# Altium project BatteryBoard.PrjPcb
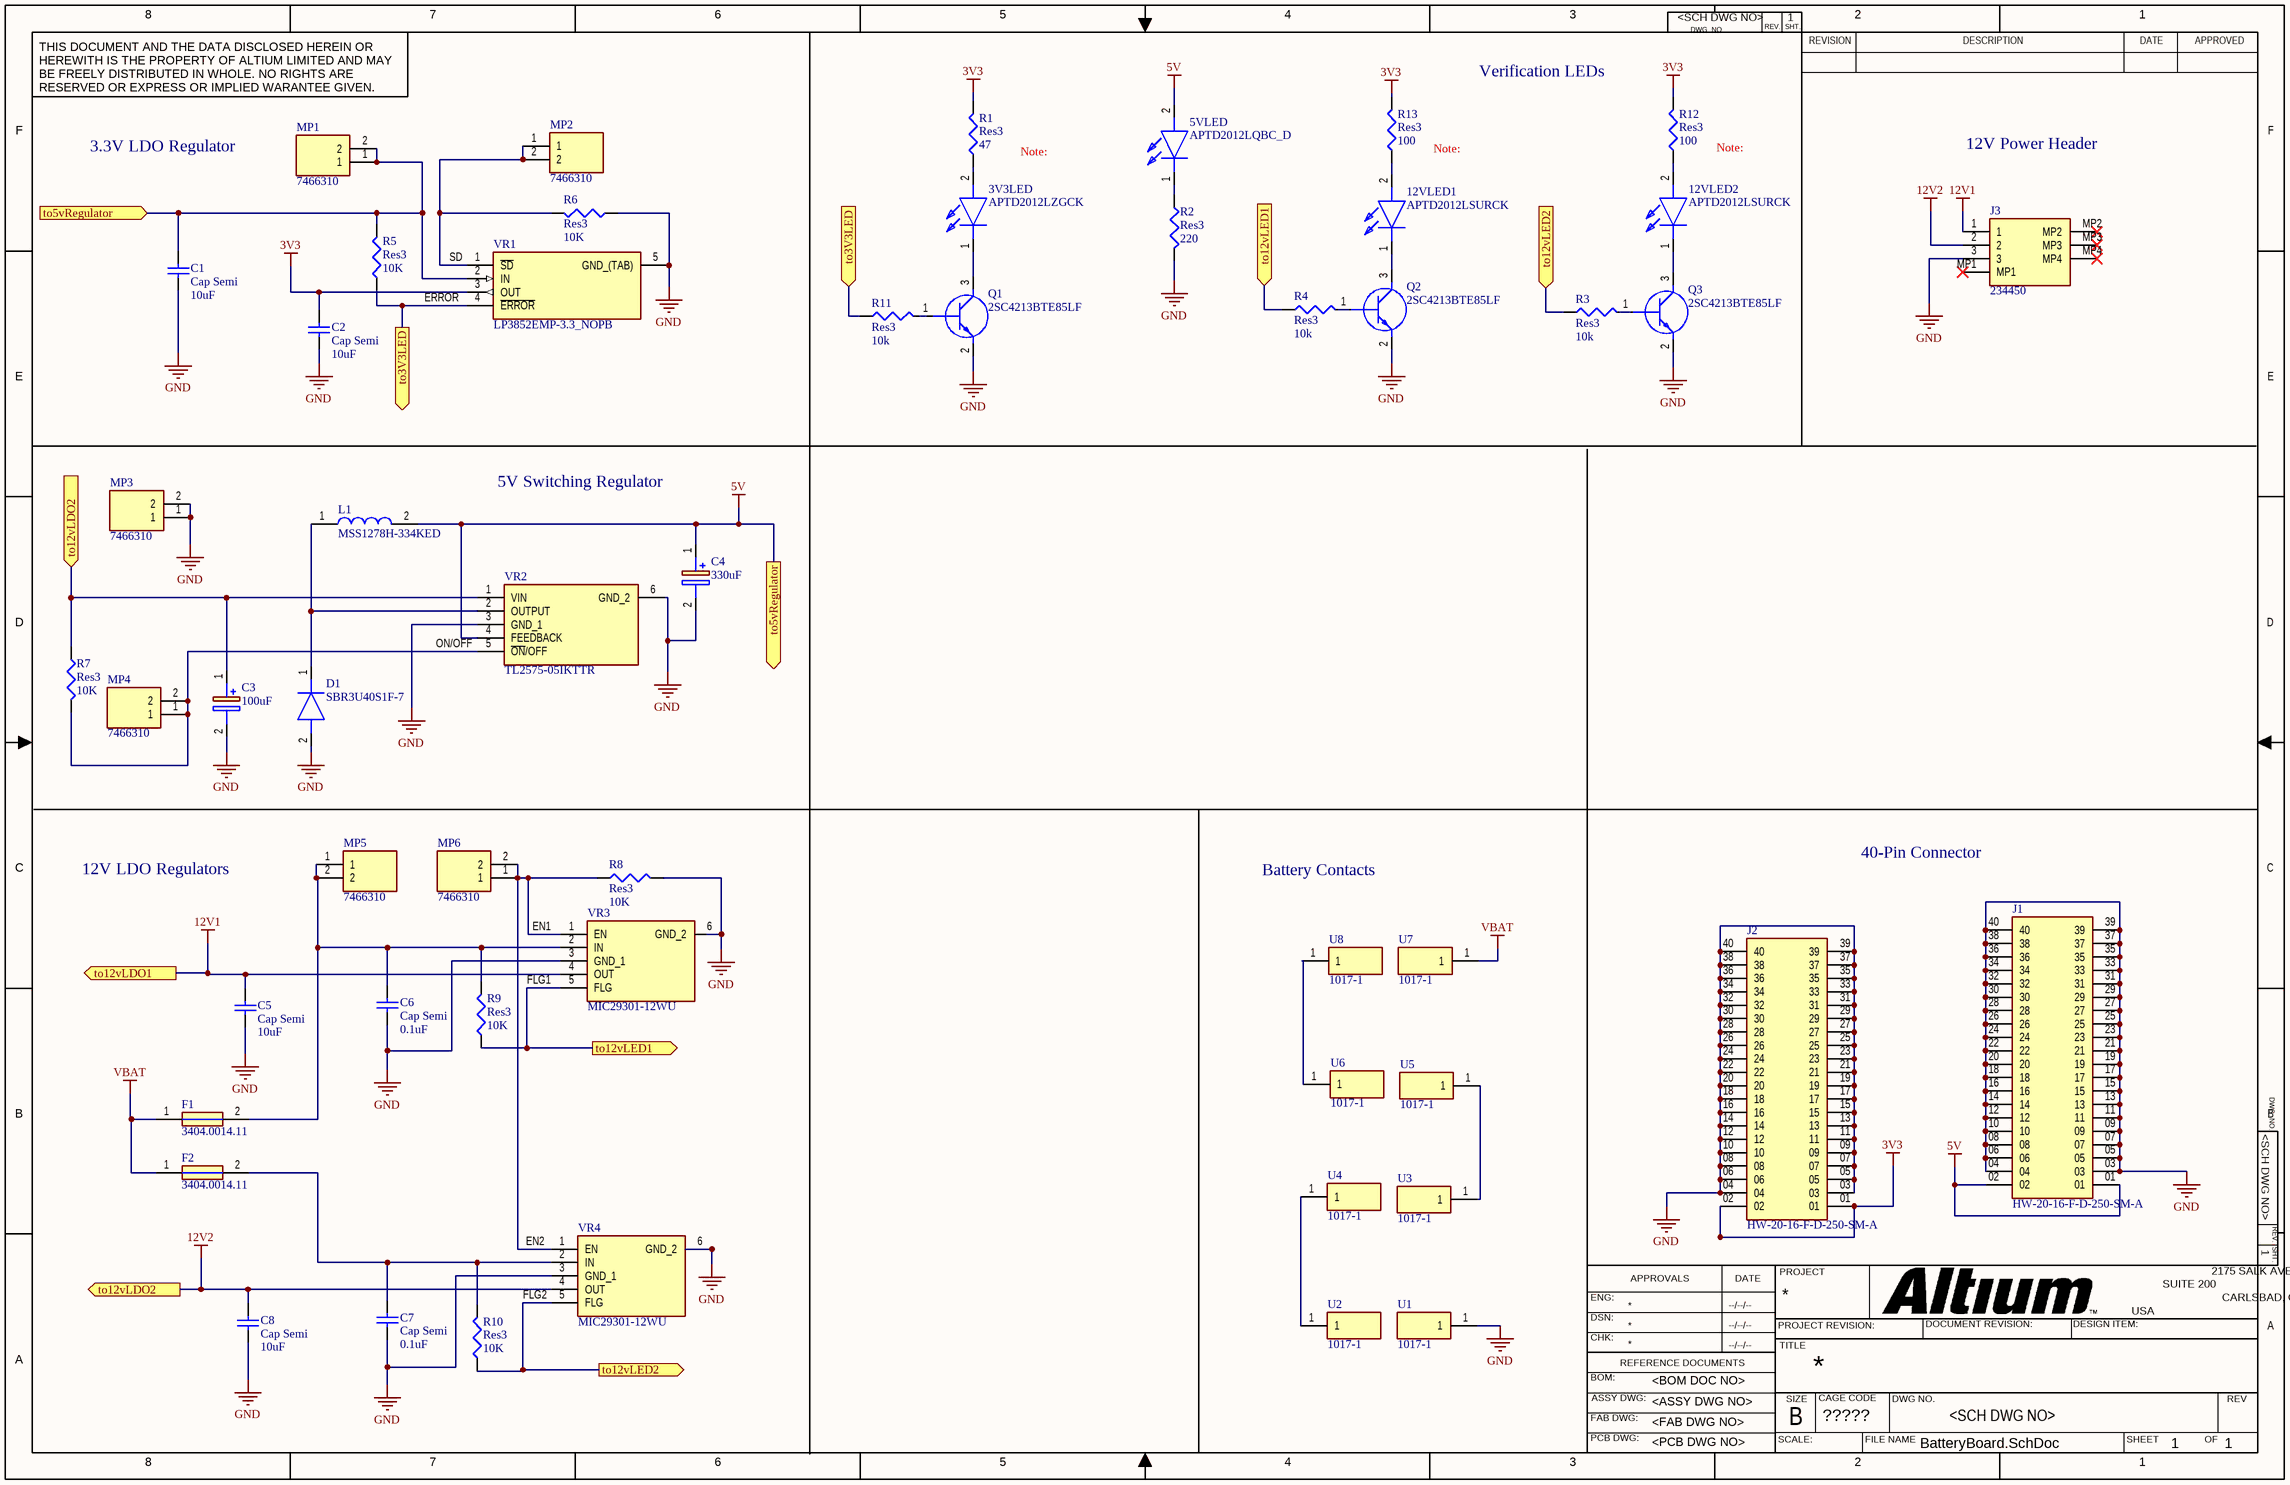
[diagram p0: BatteryBoard.SchDoc]
CAGE_CODE: ?????; CONTRACT_NUMBER: <CONTRACT NO>; DOC_NO_ASSY_DWG: <ASSY DWG NO>; DOC_NO_BOM: <BOM DOC NO>; DOC_NO_FAB_DWG: <FAB DWG NO>; DOC_NO_SCH_DWG: <SCH DWG NO>; PCB_2_DEC_TOL: +/-.01; PCB_3_DEC_TOL: +/-.010; PCB_ANG_TOL: +/-1/2; PCB_ASSEMBLY_NO: <PCB ASSY NO>; PCB_CHECKER: - -----; PCB_CHECKER_APP_DATE: --/--/----; PCB_DESIGNER: - -----; PCB_DESIGNER_APP_DATE: --/--/----; PCB_DWG_NO: <PCB DWG NO>; PCB_ENGINEER: - -----; PCB_ENGINEER_APP_DATE: --/--/----; PCB_PART_NUMBER: <PCB PN>; PCB_REV: A; SCH_REV: A
1 sheet, 53 parts. Net scope: flat (ports and power ports of the same name join across sheets).
Board file: BatteryBoard.PcbDoc

## Sheet BatteryBoard.SchDoc
size 431 x 279 mm; SheetNumber: 1; SheetTotal: 1; ENG_APP_DATE: --/--/--; DSN_APP_DATE: --/--/--; CHK_APP_DATE: --/--/--

### Parts
3V3LED  APTD2012LZGCK  [LEDC2012X105N]
5VLED  APTD2012LQBC_D  [LEDC2012X120N]
12VLED1  APTD2012LSURCK  [LEDM2012X120N]
12VLED2  APTD2012LSURCK  [LEDM2012X120N]
C1  Cap Semi  value 10uF  [C1206]
C2  Cap Semi  value 10uF  [C1206]
C3  100uF  [EEEHP1H4R7P]
C4  330uF  [CAPAE660X800N]
C5  Cap Semi  value 10uF  [C1206]
C6  Cap Semi  value 0.1uF  [C1206]
C7  Cap Semi  value 0.1uF  [C1206]
C8  Cap Semi  value 10uF  [C1206]
D1  SBR3U40S1F-7  [SODFL3518X115N]
F1  3404.0014.11  [FUSM7431X260N]
F2  3404.0014.11  [FUSM7431X260N]
J1  HW-20-16-F-D-250-SM-A  [SAMTEC_HW-20-16-F-D-250-SM-A]
J2  HW-20-16-F-D-250-SM-A  [SAMTEC_HW-20-16-F-D-250-SM-A]
J3  234450  [234450]
L1  MSS1278H-334KED  [MSS1278H334KED]
MP1  7466310  [7466310]
MP2  7466310  [7466310]
MP3  7466310  [7466310]
MP4  7466310  [7466310]
MP5  7466310  [7466310]
MP6  7466310  [7466310]
Q1  2SC4213BTE85LF  [SOT65P210X110-3N]
Q2  2SC4213BTE85LF  [SOT65P210X110-3N]
Q3  2SC4213BTE85LF  [SOT65P210X110-3N]
R1  Res3  value 47  [J1-0603]
R2  Res3  value 220  [J1-0603]
R3  Res3  value 10k  [J1-0603]
R4  Res3  value 10k  [J1-0603]
R5  Res3  value 10K  [J1-0603]
R6  Res3  value 10K  [J1-0603]
R7  Res3  value 10K  [J1-0603]
R8  Res3  value 10K  [J1-0603]
R9  Res3  value 10K  [J1-0603]
R10  Res3  value 10K  [J1-0603]
R11  Res3  value 10k  [J1-0603]
R12  Res3  value 100  [J1-0603]
R13  Res3  value 100  [J1-0603]
U1  1017-1  [10171]
U2  1017-1  [10171]
U3  1017-1  [10171]
U4  1017-1  [10171]
U5  1017-1  [10171]
U6  1017-1  [10171]
U7  1017-1  [10171]
U8  1017-1  [10171]
VR1  LP3852EMP-3.3_NOPB  [SOT150P700X180-5N]
VR2  TL2575-05IKTTR  [TL1963AQKTTRQ1]
VR3  MIC29301-12WU  [MIC2930133WUTR]
VR4  MIC29301-12WU  [MIC2930133WUTR]

### Ports
to3V3LED (in), to3V3LED (out), to5vRegulator (in), to5vRegulator (out), to12vLDO1 (out), to12vLDO2 (in), to12vLDO2 (out), to12vLED1 (in), to12vLED1 (out), to12vLED2 (in), to12vLED2 (out)

### Nets
3V3: C2.2 J2.01 J2.02 R1.2 R12.2 R13.2 VR1.3(OUT)
5V: 5VLED.2(A) C1.2 C4.1(+) J1.01 J1.02 L1.2 MP1.1 MP1.2 R5.2 VR1.2(IN) VR2.4(FEEDBACK) ; port to5vRegulator
12V1: C5.2 J3.1 VR3.4(OUT) ; port to12vLDO1
12V2: C3.1(+) C8.2 J3.2 R7.1 VR2.1(VIN) VR4.4(OUT) ; port to12vLDO2
GND: C1.1 C2.1 C3.2(-) C4.2(-) C5.1 C6.2 C7.2 C8.1 D1.2(A) J1.03 J1.04 J1.05 J1.06 J1.07 J1.08 J1.09 J1.10 J1.11 J1.12 J1.13 J1.14 J1.15 J1.16 J1.17 J1.18 J1.19 J1.20 J1.21 J1.22 J1.23 J1.24 J1.25 J1.26 J1.27 J1.28 J1.29 J1.30 J1.31 J1.32 J1.33 J1.34 J1.35 J1.36 J1.37 J1.38 J1.39 J1.40 J2.03 J2.04 J2.05 J2.06 J2.07 J2.08 J2.09 J2.10 J2.11 J2.12 J2.13 J2.14 J2.15 J2.16 J2.17 J2.18 J2.19 J2.20 J2.21 J2.22 J2.23 J2.24 J2.25 J2.26 J2.27 J2.28 J2.29 J2.30 J2.31 J2.32 J2.33 J2.34 J2.35 J2.36 J2.37 J2.38 J2.39 J2.40 J3.3 MP3.1 MP3.2 Q1.2(E) Q2.2(E) Q3.2(E) R2.2 R6.1 R8.2 U1.1 VR1.5(GND_(TAB)) VR2.3(GND_1) VR2.6(GND_2) VR3.3(GND_1) VR3.6(GND_2) VR4.3(GND_1) VR4.6(GND_2)
VBAT: F1.1 F2.1 U7.1
EN1: MP6.1 MP6.2 R8.1 VR3.1(EN) VR4.1(EN)  [also labelled EN2]
ERROR: R5.1 R11.1 VR1.4(~{ERROR}) ; port to3V3LED
FLG1: R4.1 R9.1 VR3.5(FLG) ; port to12vLED1
FLG2: R3.1 R10.1 VR4.5(FLG) ; port to12vLED2
ON/OFF: MP4.1 MP4.2 R7.2 VR2.5(~{ON}/OFF)
SD: MP2.1 MP2.2 R6.2 VR1.1(~{SD})
Net3V3LED_1: 3V3LED.1(K) Q1.3(C)
Net3V3LED_2: 3V3LED.2(A) R1.1
Net5VLED_1: 5VLED.1(K) R2.1
Net12VLED1_1: 12VLED1.1(K) Q2.3(C)
Net12VLED1_2: 12VLED1.2(A) R13.1
Net12VLED2_1: 12VLED2.1(K) Q3.3(C)
Net12VLED2_2: 12VLED2.2(A) R12.1
NetC6_1: C6.1 F1.2 MP5.1 MP5.2 R9.2 VR3.2(IN)
NetC7_1: C7.1 F2.2 R10.2 VR4.2(IN)
NetD1_1: D1.1(K) L1.1 VR2.2(OUTPUT)
NetQ1_1: Q1.1(B) R11.2
NetQ2_1: Q2.1(B) R4.2
NetQ3_1: Q3.1(B) R3.2
NetU2_1: U2.1 U4.1
NetU3_1: U3.1 U5.1
NetU6_1: U6.1 U8.1

Not connected (* = marked no-connect by the designer): J3 MP1* MP2* MP3* MP4*

### Notes on the sheet
- Verification LEDs
- 3.3V LDO Regulator
- Note:
- 12V Power Header
- 5V Switching Regulator
- 12V LDO Regulators
- Battery Contacts
- 40-Pin Connector
- 8
- 7
- 6
- 5
- 4
- 3
- DWG. NO.
- REV.
- SHT.
- 2
- 1
- THIS DOCUMENT AND THE DATA DISCLOSED HEREIN OR HEREWITH IS THE PROPERTY OF ALTIUM LIMITED AND MAY BE FREELY DISTRIBUTED IN WHOLE. NO RIGHTS ARE RESERVED OR EXPRESS OR IMPLIED WARANTEE GIVEN.
- REVISION
- DESCRIPTION
- DATE
- APPROVED
- F
- E
- D
- C
- B
- ENG:
- APPROVALS
- PROJECT
- SUITE 200
- 2175 SALK AVENUE
- CARLSBAD, CA 92008
- A
- DSN:
- CHK:
- REFERENCE DOCUMENTS
- PROJECT REVISION:
- TITLE
- DOCUMENT REVISION:
- DESIGN ITEM:
- USA
- BOM:
- FAB DWG:
- PCB DWG:
- ASSY DWG:
- SCALE:
- SIZE
- CAGE CODE
- FILE NAME
- DWG NO.
- SHEET
- OF
- REV

### Library data of the parts
3V3LED = APTD2012LZGCK: LED; Manufacturer_Name: Kingbright; Datasheet Link: http://www.kingbrightusa.com/images/catalog/SPEC/APTD2012LZGCK.pdf; Height: 1.05mm; Manufacturer_Part_Number: APTD2012LZGCK; Mouser Part Number: 604-APTD2012LZGCK; Mouser Price/Stock: https://www.mouser.co.uk/ProductDetail/Kingbright/APTD2012LZGCK?qs=AQlKX63v8RvUnlqpSGhMeA%3D%3D; Arrow Part Number: APTD2012LZGCK; Arrow Price/Stock: https://www.arrow.com/en/products/aptd2012lzgck/kingbright?region=nac
5VLED = APTD2012LQBC_D: LED; Manufacturer_Name: Kingbright; Manufacturer_Part_Number: APTD2012LQBC/D; Datasheet Link: https://componentsearchengine.com/Datasheets/1/APTD2012LQBC_D.pdf; Height: 1.2mm; Mouser Part Number: 604-APTD2012LQBCD; Mouser Price/Stock: https://www.mouser.co.uk/ProductDetail/Kingbright/APTD2012LQBC-D?qs=AQlKX63v8RvDGqprk6aUCg%3D%3D; Arrow Part Number: APTD2012LQBC/D; Arrow Price/Stock: https://www.arrow.com/en/products/aptd2012lqbcd/kingbright?region=nac
12VLED1 12VLED2 = APTD2012LSURCK: LED; Manufacturer_Name: Kingbright; Datasheet Link: http://www.kingbrightusa.com/images/catalog/SPEC/APTD2012LSURCK.pdf; Height: 1.2mm; Manufacturer_Part_Number: APTD2012LSURCK; Mouser Part Number: 604-APTD2012LSURCK; Mouser Price/Stock: https://www.mouser.co.uk/ProductDetail/Kingbright/APTD2012LSURCK?qs=AQlKX63v8RvkMadNvwbkxw%3D%3D; Arrow Part Number: APTD2012LSURCK; Arrow Price/Stock: https://www.arrow.com/en/products/aptd2012lsurck/kingbright?region=nac
C1 C2 C5-C8 = Cap Semi: Capacitor (Semiconductor SIM Model); Published: 8-Jun-2000; LatestRevisionDate: 29-May-2009; LatestRevisionNote: IPC-7351 Footprint Added.; PackageReference: C1206; Publisher: Altium Limited; PackageDescription: Chip Capacitor
C3 = EEE-FPE101XAL: Capacitor Polarised; Manufacturer_Name: Panasonic; Datasheet Link: http://industrial.panasonic.com/cdbs/www-data/pdf/RDE0000/RDE0000C1272.pdf; Manufacturer_Part_Number: EEE-FPE101XAL; Mouser Part Number: 667-EEE-FPE101XAL; Mouser Price/Stock: https://www.mouser.co.uk/ProductDetail/Panasonic/EEE-FPE101xAL?qs=vmHwEFxEFR%2FU1ayQL%252BhZlg%3D%3D; Arrow Part Number: EEE-FPE101XAL; Arrow Price/Stock: https://www.arrow.com/en/products/eee-fpe101xal/panasonic?region=nac
C4 = EMZR160ARA331MF80G: Capacitor Polarised; Manufacturer_Name: Chemi-Con; Datasheet Link: https://datasheet.datasheetarchive.com/originals/distributors/DKDS-39/4980.pdf; Height: 8mm; Manufacturer_Part_Number: EMZR160ARA331MF80G; Mouser Part Number: 661-EMZR160ARA331MF8; Mouser Price/Stock: https://www.mouser.co.uk/ProductDetail/United-Chemi-Con/EMZR160ARA331MF80G?qs=y6ZabgHbY%252BxNFfWWRjsyvw%3D%3D; Arrow Part Number: EMZR160ARA331MF80G; Arrow Price/Stock: https://www.arrow.com/en/products/emzr160ara331mf80g/united-chemi-con
D1 = SBR3U40S1F-7: Diode; Manufacturer_Name: Diodes Incorporated; Datasheet Link: https://www.arrow.com/en/products/sbr3u40s1f-7/diodes-incorporated; Height: 1.15mm; Manufacturer_Part_Number: SBR3U40S1F-7; Mouser Part Number: 621-SBR3U40S1F-7; Mouser Price/Stock: https://www.mouser.co.uk/ProductDetail/Diodes-Incorporated/SBR3U40S1F-7?qs=HXFqYaX1Q2yP2B8FJNWOhg%3D%3D; Arrow Part Number: SBR3U40S1F-7; Arrow Price/Stock: https://www.arrow.com/en/products/sbr3u40s1f-7/diodes-incorporated
F1 F2 = 3404.0014.11: Fuse; Manufacturer_Name: SCHURTER; Datasheet Link: https://www.schurter.sg/en/datasheet/typ_OMF_125.pdf; Height: 2.6mm; Manufacturer_Part_Number: 3404.0014.11; Mouser Part Number: 693-3404.0014.11; Mouser Price/Stock: https://www.mouser.co.uk/ProductDetail/Schurter/3404001411?qs=8QfiMw8FY5MW%252BuaV2dEayA%3D%3D; Arrow Part Number: 3404.0014.11; Arrow Price/Stock: https://www.arrow.com/en/products/3404.0014.11/schurter?region=europe
J3 = 234450: Connector; Manufacturer_Name: ERNI; Datasheet Link: https://www.erni.com/fileadmin/import/products/assets/DC0000169.PDF; Height: 2.98mm; Manufacturer_Part_Number: 234450; Mouser Part Number: 305-234450; Mouser Price/Stock: https://www.mouser.co.uk/ProductDetail/ERNI/234450?qs=DK05bRAVOD4CDOGVl35lNg%3D%3D; Arrow Part Number: 234450; Arrow Price/Stock: https://www.arrow.com/en/products/234450/erni-electronics?region=europe
L1 = MSS1278H-334KED: Inductor; Manufacturer_Name: COILCRAFT; Datasheet Link: https://4donline.ihs.com/images/VipMasterIC/IC/COLC/COLC-S-A0010155479/COLC-S-A0010155479-1.pdf?hkey=EF798316E3902B6ED9A73243A3159BB0; Height: 8.05mm; Manufacturer_Part_Number: MSS1278H-334KED; Mouser Part Number: 994-MSS1278H-334KED; Mouser Price/Stock: https://www.mouser.co.uk/ProductDetail/Coilcraft/MSS1278H-334KED?qs=KUoIvG%2F9IlYsPneJA3QIdw%3D%3D
MP1-MP6 = 7466310: Terminals WP-SMRA SMD w/Pins 5.5mm; Manufacturer_Name: Wurth Elektronik; Geometry.Height: 7mm; Manufacturer_Part_Number: 7466310; Mouser Part Number: 710-7466310; Mouser Price/Stock: https://www.mouser.co.uk/ProductDetail/Wurth-Elektronik/7466310?qs=HXFqYaX1Q2wJWeDTYvGsCg%3D%3D; Arrow Part Number: *; Arrow Price/Stock: *; Datasheet Link: https://www.we-online.com/catalog/datasheet/7466310.pdf
Q1-Q3 = 2SC4213BTE85LF: Transistor BJT NPN; Manufacturer_Name: Toshiba; Datasheet Link: http://toshiba.semicon-storage.com/info/docget.jsp?did=19305&prodName=2SC4213; Height: 1.1mm; Manufacturer_Part_Number: 2SC4213BTE85LF; Mouser Part Number: 757-2SC4213BTE85LF; Mouser Price/Stock: https://www.mouser.co.uk/ProductDetail/Toshiba/2SC4213BTE85LF?qs=3kEcuH7qFhdqHZKOo23uyA%3D%3D
R1-R13 = Res3: Resistor; Published: 8-Jun-2000; LatestRevisionDate: 29-May-2009; LatestRevisionNote: IPC-7351 Footprint Added.; PackageReference: J1-0603; Publisher: Altium Limited; PackageDescription: Chip Resistor
U1-U8 = 1017-1: Undefined or Miscellaneous; Manufacturer_Name: Keystone Electronics; Datasheet Link: https://componentsearchengine.com/Datasheets/1/1017-1.pdf; Height: 13.84mm; Manufacturer_Part_Number: 1017-1; Mouser Part Number: 534-1017-1; Mouser Price/Stock: https://www.mouser.co.uk/ProductDetail/Keystone-Electronics/1017-1?qs=wOxb8XianXhq6%252BfB2t0c2Q%3D%3D
VR1 = LP3852EMP-3.3_NOPB: Integrated Circuit; Manufacturer_Name: Texas Instruments; Manufacturer_Part_Number: LP3852EMP-3.3/NOPB; Datasheet Link: http://www.ti.com/lit/ds/symlink/lp3852.pdf; Height: 1.8mm; Mouser Part Number: 926-LP3852EMP33NOPB; Mouser Price/Stock: https://www.mouser.co.uk/ProductDetail/Texas-Instruments/LP3852EMP-33-NOPB?qs=1FNqv8aZn1SurWe7DNzDPA%3D%3D; Arrow Part Number: LP3852EMP-3.3/NOPB; Arrow Price/Stock: https://www.arrow.com/en/products/lp3852emp-3.3nopb/texas-instruments
VR2 = TL2575-05IKTTR: Integrated Circuit; Manufacturer_Name: Texas Instruments; Datasheet Link: http://www.ti.com/lit/gpn/tl2575-05; Height: 4mm; Manufacturer_Part_Number: TL2575-05IKTTR; Mouser Part Number: 595-TL2575-05IKTTR; Mouser Price/Stock: https://www.mouser.co.uk/ProductDetail/Texas-Instruments/TL2575-05IKTTR?qs=EnLMdcWnKADvl92kjFJdog%3D%3D; Arrow Part Number: TL2575-05IKTTR; Arrow Price/Stock: https://www.arrow.com/en/products/tl2575-05ikttr/texas-instruments?region=nac
VR3 VR4 = MIC29301-3.3WU-TR: Integrated Circuit; Manufacturer_Name: Microchip; Datasheet Link: http://www.microchip.com/mymicrochip/filehandler.aspx?ddocname=en580805; Height: 5.08mm; Manufacturer_Part_Number: MIC29301-3.3WU-TR; Mouser Part Number: 998-MIC29301-3.3WUTR; Mouser Price/Stock: https://www.mouser.co.uk/ProductDetail/Microchip-Technology/MIC29301-3.3WU-TR?qs=U6T8BxXiZAWJme4uExHM0Q%3D%3D; Arrow Part Number: MIC29301-3.3WU-TR; Arrow Price/Stock: https://www.arrow.com/en/products/mic29301-3.3wu-tr/microchip-technology
J1 J2 = HW-20-16-F-D-250-SM-A: Package: None; Price: None; Value: *; MP: HW-20-16-F-D-250-SM-A; Availability: Unavailable